# EAGLE design 3StepV1 (EAGLE 9.3.0)
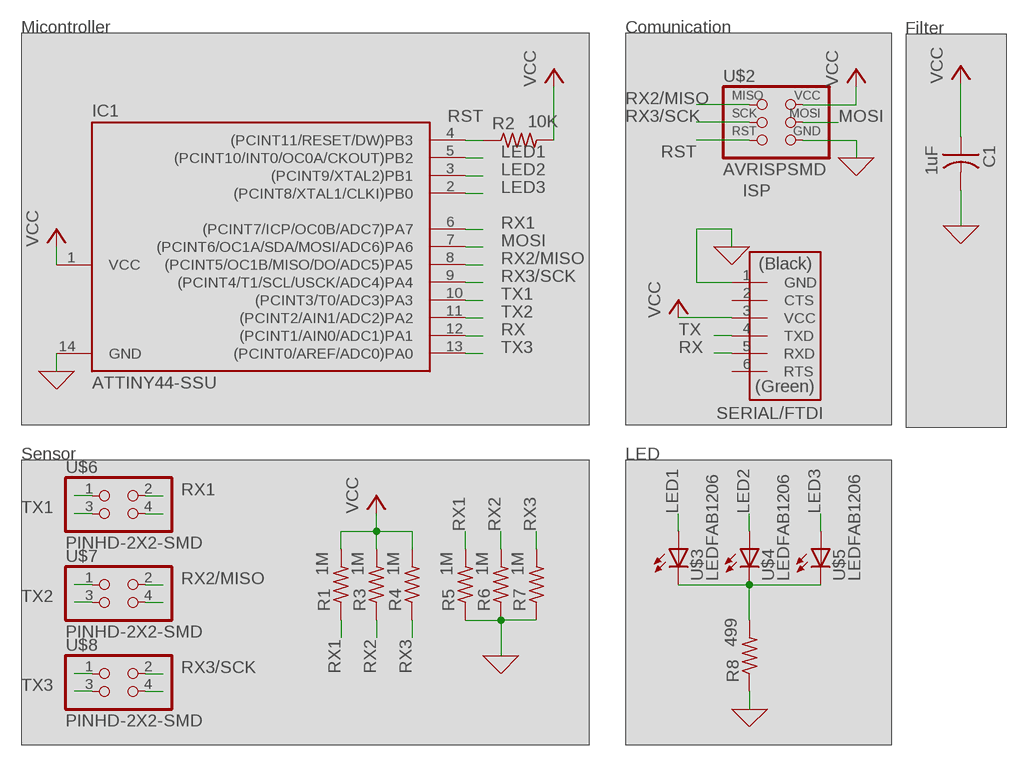
[diagram p0: schematic, sheet 1]

## Parts
C1  1uF  CAP-US1206FAB  [C1206FAB]
IC1  ATTINY44-SSU  [SOIC14]
R1  1M  RES-US1206FAB  [R1206FAB]
R2  10K  RES-US1206FAB  [R1206FAB]
R3  1M  RES-US1206FAB  [R1206FAB]
R4  1M  RES-US1206FAB  [R1206FAB]
R5  1M  RES-US1206FAB  [R1206FAB]
R6  1M  RES-US1206FAB  [R1206FAB]
R7  1M  RES-US1206FAB  [R1206FAB]
R8  499  RES-US1206FAB  [R1206FAB]
U$1  FTDI-SMD-HEADER  [1X06SMD]
U$2  AVRISPSMD  [2X03SMD]
U$3  LEDFAB1206  [LED1206FAB]
U$4  LEDFAB1206  [LED1206FAB]
U$5  LEDFAB1206  [LED1206FAB]
U$6  PINHD-2X2-SMD  [2X02SMD]
U$7  PINHD-2X2-SMD  [2X02SMD]
U$8  PINHD-2X2-SMD  [2X02SMD]

## Nets
0: C1.2 IC1.14(GND) R5.1 R6.1 R7.1 R8.1 U$1.1(GND) U$2.6(GND) ; supply symbol labelled GND
LED1: IC1.5((PCINT10/INT0/OC0A/CKOUT)PB2) U$3.1(A)
LED2: IC1.3((PCINT9/XTAL2)PB1) U$4.1(A)
LED3: IC1.2((PCINT8/XTAL1/CLKI)PB0) U$5.1(A)
MOSI: IC1.7((PCINT6/OC1A/SDA/MOSI/ADC6)PA6) U$2.4(MOSI)
N$1: R8.2 U$3.2(C) U$4.2(C) U$5.2(C)
N$3: U$6.4
N$5: U$6.1
N$7: U$7.4
N$8: U$7.1
N$11: U$8.4
N$13: U$8.1
RST: IC1.4((PCINT11/RESET/DW)PB3) R2.1 U$2.5(RST)
RX: IC1.12((PCINT1/AIN0/ADC1)PA1) U$1.5(RXD)
RX1: IC1.6((PCINT7/ICP/OC0B/ADC7)PA7) R1.1 R5.2 U$6.2
RX2: R3.1 R6.2
RX2/MISO: IC1.8((PCINT5/OC1B/MISO/DO/ADC5)PA5) U$2.1(MISO) U$7.2
RX3: R4.1 R7.2
RX3/SCK: IC1.9((PCINT4/T1/SCL/USCK/ADC4)PA4) U$2.3(SCK) U$8.2
TX: U$1.4(TXD)
TX1: IC1.10((PCINT3/T0/ADC3)PA3) U$6.3
TX2: IC1.11((PCINT2/AIN1/ADC2)PA2) U$7.3
TX3: IC1.13((PCINT0/AREF/ADC0)PA0) U$8.3
VCC: C1.1 IC1.1(VCC) R1.2 R2.2 R3.2 R4.2 U$1.3(VCC) U$2.2(VCC)
Unconnected: U$1.2(CTS) U$1.6(RTS)

## Notes on the sheet
- Micontroller | Comunication | Filter
- ISP
- SERIAL/FTDI
- Sensor | LED

## Library data of the parts
C1 = fab:CAP-US
IC1 = fab:ATTINY44
R1-R8 = fab:RES-US: Resistor (US Symbol) Variants with postfix FAB are widened to allow the routing of internal traces
U$1 = fab:FTDI-SMD-HEADER
U$2 = fab:AVRISP
U$3-U$5 = fab:LED: LED
U$6-U$8 = fab:PINHD-2X2-SMD

## Board
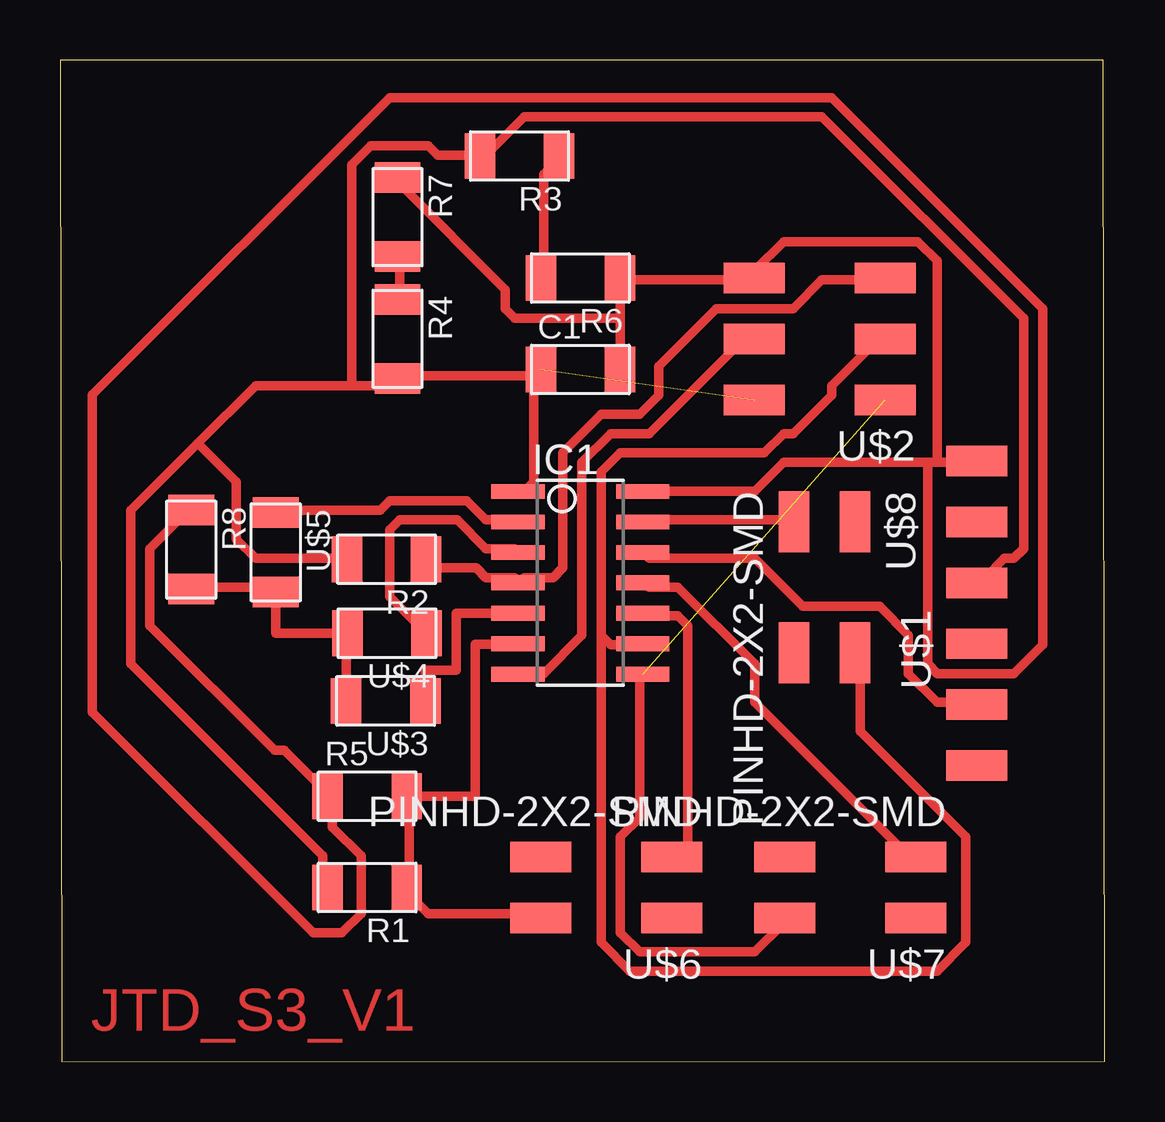
[diagram p1: board, top side]

Size 43.54 x 41.74 mm. Coordinates in mm from the lower left corner, seen from the top.
Outline: 0.07,0 43.54,0.01 43.47,41.74 0,41.73 0.07,0
Copper layers (1*16): Top 0.035mm / dielectric 1.5mm / Bottom 0.035mm
Design rules "default *": minimum track width 0.4mm, minimum drill 0.35mm, track to track 0.4mm, track to pad 0.4mm, pad to pad 0.4mm, via to via 0.4mm, smd to smd 0.4mm, copper to edge 40mil, drill to drill 6mil, minimum pad ring 10mil, minimum via ring 8mil, stop-mask expansion 4mil, vias tented up to drill 0mil, thermal gap 10mil

### Footprints (pad centres in the part's own frame; a part is rotated, then mirrored left to right if it is on the bottom)
C1206FAB = smd 1.27 x 1.905: 1 -1.651,0; 2 1.651,0
SOIC14 = smd 0.61 x 2.21: 1 -3.81,-2.603; 2 -2.54,-2.603; 3 -1.27,-2.603; 4 0,-2.603; 5 1.27,-2.603; 6 2.54,-2.603; 7 3.81,-2.603; 8 3.81,2.603; 9 2.54,2.603; 10 1.27,2.603; 11 0,2.603; 12 -1.27,2.603; 13 -2.54,2.603; 14 -3.81,2.603
R1206FAB = smd 1.27 x 1.905: 1 -1.651,0; 2 1.651,0
1X06SMD = smd 2.54 x 1.27: 1 0,6.35; 2 0,3.81; 3 0,1.27; 4 0,-1.27; 5 0,-3.81; 6 0,-6.35
2X03SMD = smd 2.54 x 1.27: 1 -2.54,2.54; 2 2.92,2.54; 3 -2.54,0; 4 2.92,0; 5 -2.54,-2.54; 6 2.92,-2.54
LED1206FAB = smd 1.27 x 1.905: 1 -1.651,0; 2 1.651,0
2X02SMD = smd 2.54 x 1.27: 1 -2.54,1.27; 2 2.92,1.27; 3 -2.54,-1.27; 4 2.92,-1.27

### Placement (x,y rotation side)
C1  21.69,28.85 0 top
IC1  21.69,19.96 270 top
R1  12.8,7.26 180 top
R2  13.61,20.94 180 top
R3  19.15,37.74 180 top
R4  14.07,30.12 270 top
R5  12.8,11.07 0 top
R6  21.69,32.66 180 top
R7  14.07,35.2 270 top
R8  5.47,21.34 270 top
U$1  38.2,18.69 0 top
U$2  31.85,30.12 180 top
U$3  13.57,15.04 180 top
U$4  13.62,17.86 180 top
U$5  8.99,21.23 270 top
U$6  22.96,7.26 180 top
U$7  33.12,7.26 180 top
U$8  31.85,19.96 270 top

### Tracks (layer width: path | path; a pad name or v marks a point on that pad's centre or on a via)
0
  Top 0.4: R8.1 5.35,22.98 3.75,21.38 3.75,18.18 8.95,12.98 9.35,12.98 10.95,11.38 R5.1 11.35,10.98 11.35,9.78 12.55,8.58 12.55,6.18 11.75,5.38 10.55,5.38 1.35,14.57 1.35,27.79 13.75,40.18 32.15,40.18 40.95,31.38 40.95,17.38 39.75,16.18 36.55,16.18 36.15,16.58 36.15,24.98 | 36.55,24.98 38.15,24.98 U$1.1 | 36.55,24.98 36.15,24.98 | 36.15,24.98 30.15,24.98 28.95,23.78 24.55,23.78 IC1.14 | 23.35,32.58 23.35,30.98 | 23.35,30.98 23.35,28.98 C1.2 | 23.35,30.98 18.95,30.98 18.55,31.38 18.55,32.18 14.15,36.58 R7.1 | 23.35,32.58 28.55,32.58 U$2.6 28.95,32.98 30.15,34.18 35.75,34.18 36.55,33.38 36.55,24.98 | 23.35,32.58 R6.1
LED1
  Top 0.4: IC1.5 16.51,18.69 16.51,16.31 15.22,16.31 U$3.1
LED2
  Top 0.4: U$4.1 14.95,18.18 13.75,19.38 13.75,22.18 14.15,22.58 16.55,22.58 17.75,21.38 18.95,21.38 IC1.3
LED3
  Top 0.4: U$5.1 9.35,22.98 13.35,22.98 13.75,23.38 16.95,23.38 17.75,22.58 18.95,22.58 IC1.2
MOSI
  Top 0.4: IC1.7 19.35,16.18 20.15,16.18 21.75,17.78 21.75,24.98 22.95,26.18 24.55,26.18 28.55,30.18 U$2.4
N$1
  Top 0.4: 11.75,17.78 U$4.2 | 9.35,19.38 U$5.2 | R8.2 5.75,19.78 8.95,19.78 U$5.2 | U$3.2 11.92,17.86 U$4.2 | U$4.2 8.99,17.86 U$5.2
RST
  Top 0.4: R2.1 15.35,20.58 17.35,20.58 17.75,20.18 18.95,20.18 IC1.4 19.35,20.18 20.55,20.18 20.95,20.58 20.95,25.38 22.55,26.98 24.15,26.98 24.95,27.78 24.95,28.98 27.35,31.38 30.55,31.38 31.75,32.58 34.15,32.58 U$2.5
RX
  Top 0.4: IC1.12 24.55,20.98 28.95,20.98 30.95,18.98 34.15,18.98 35.35,17.78 35.35,16.18 36.55,14.98 38.15,14.98 U$1.5
RX1
  Top 0.4: R5.2 14.55,10.98 14.55,7.38 R1.1 14.55,6.98 15.35,6.18 19.75,6.18 U$6.2 | IC1.6 18.95,17.38 18.95,17.41 17.31,17.41 17.31,11.07 R5.2 | 14.55,11.38 R5.2
RX2
  Top 0.4: R6.2 20.15,32.98 20.15,36.98 20.55,37.38 R3.1
RX2/MISO  (1 unrouted)
  Top 0.4: IC1.8 24.15,16.18 24.15,10.18 23.35,9.38 23.35,5.38 24.15,4.58 28.95,4.58 30.15,5.78 U$7.2
RX3
  Top 0.4: R4.1 14.15,31.78 14.15,33.38 R7.2
RX3/SCK
  Top 0.4: 22.55,17.78 22.95,17.38 24.15,17.38 IC1.9 | 22.55,17.78 22.55,24.58 23.35,25.38 29.35,25.38 30.15,26.18 30.55,26.18 32.15,27.78 32.15,28.18 34.15,30.18 U$2.3 | 22.55,17.78 22.55,4.98 23.75,3.78 36.55,3.78 37.75,4.98 37.75,9.38 33.35,13.78 33.35,16.98 U$8.2
TX1
  Top 0.4: IC1.10 24.55,18.58 25.75,18.58 26.15,18.18 26.15,8.98 25.75,8.58 U$6.3
TX2
  Top 0.4: IC1.11 24.55,19.78 25.75,19.78 28.95,16.58 28.95,14.98 35.35,8.58 U$7.3
TX3
  Top 0.4: IC1.13 24.55,22.58 30.55,22.58 U$8.3
VCC  (1 unrouted)
  Top 0.4: 19.75,28.58 19.75,24.18 19.35,23.78 IC1.1 | 5.75,25.78 8.15,28.18 12.15,28.18 | 5.75,25.78 2.95,22.98 2.95,16.58 10.95,8.58 10.95,7.38 R1.2 | 12.15,28.18 13.75,28.18 R4.2 14.15,28.58 19.75,28.58 | 5.75,25.78 7.35,24.18 7.35,21.78 8.15,20.98 11.75,20.98 R2.2 | 12.15,28.18 12.15,37.38 12.95,38.18 15.35,38.18 15.75,37.78 17.35,37.78 R3.2 17.75,37.78 19.35,39.38 31.75,39.38 40.15,30.98 40.15,21.38 39.75,20.98 39.35,20.98 38.55,20.18 U$1.3 | 19.75,28.58 C1.1

### Text on the board
Top: JTD_S3_V1